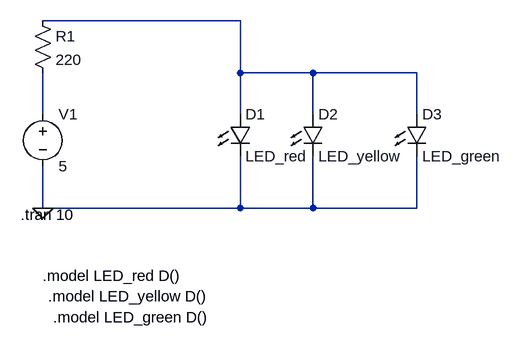
[diagram p0: schematic traffic_light_vol1_circuit.asc]
traffic_light_vol1_circuit.asc, the LTspice schematic file:
Version 4
SHEET 1 880 680
WIRE 368 -32 64 -32
WIRE 368 48 368 -32
WIRE 480 48 368 48
WIRE 640 48 480 48
WIRE 64 112 64 48
WIRE 368 112 368 48
WIRE 480 112 480 48
WIRE 640 112 640 48
WIRE 64 256 64 192
WIRE 368 256 368 176
WIRE 368 256 64 256
WIRE 480 256 480 176
WIRE 480 256 368 256
WIRE 640 256 640 176
WIRE 640 256 480 256
FLAG 64 256 0
SYMBOL voltage 64 96 R0
WINDOW 123 0 0 Left 0
WINDOW 39 0 0 Left 0
SYMATTR InstName V1
SYMATTR Value 5
SYMBOL LED 352 112 R0
SYMATTR InstName D1
SYMATTR Value LED_red
SYMBOL LED 464 112 R0
SYMATTR InstName D2
SYMATTR Value LED_yellow
SYMBOL LED 624 112 R0
SYMATTR InstName D3
SYMATTR Value LED_green
SYMBOL res 48 -48 R0
SYMATTR InstName R1
SYMATTR Value 220
TEXT 30 266 Left 2 !.tran 10
TEXT 64 360 Left 2 !.model LED_red D()
TEXT 72 392 Left 2 !.model LED_yellow D()
TEXT 80 424 Left 2 !.model LED_green D()

The netlist it stands for:
* traffic_light_vol1_circuit.asc
V1 N002 0 5
D1 N001 0 LED_red
D2 N001 0 LED_yellow
D3 N001 0 LED_green
R1 N001 N002 220
.model D D
.lib standard.dio
.tran 10
.model LED_red D()
.model LED_yellow D()
.model LED_green D()
.backanno
.end